# EAGLE design stm32h405-braids-panel (EAGLE 7.3.0)
UI for Olimex STM32H103 or H405 board
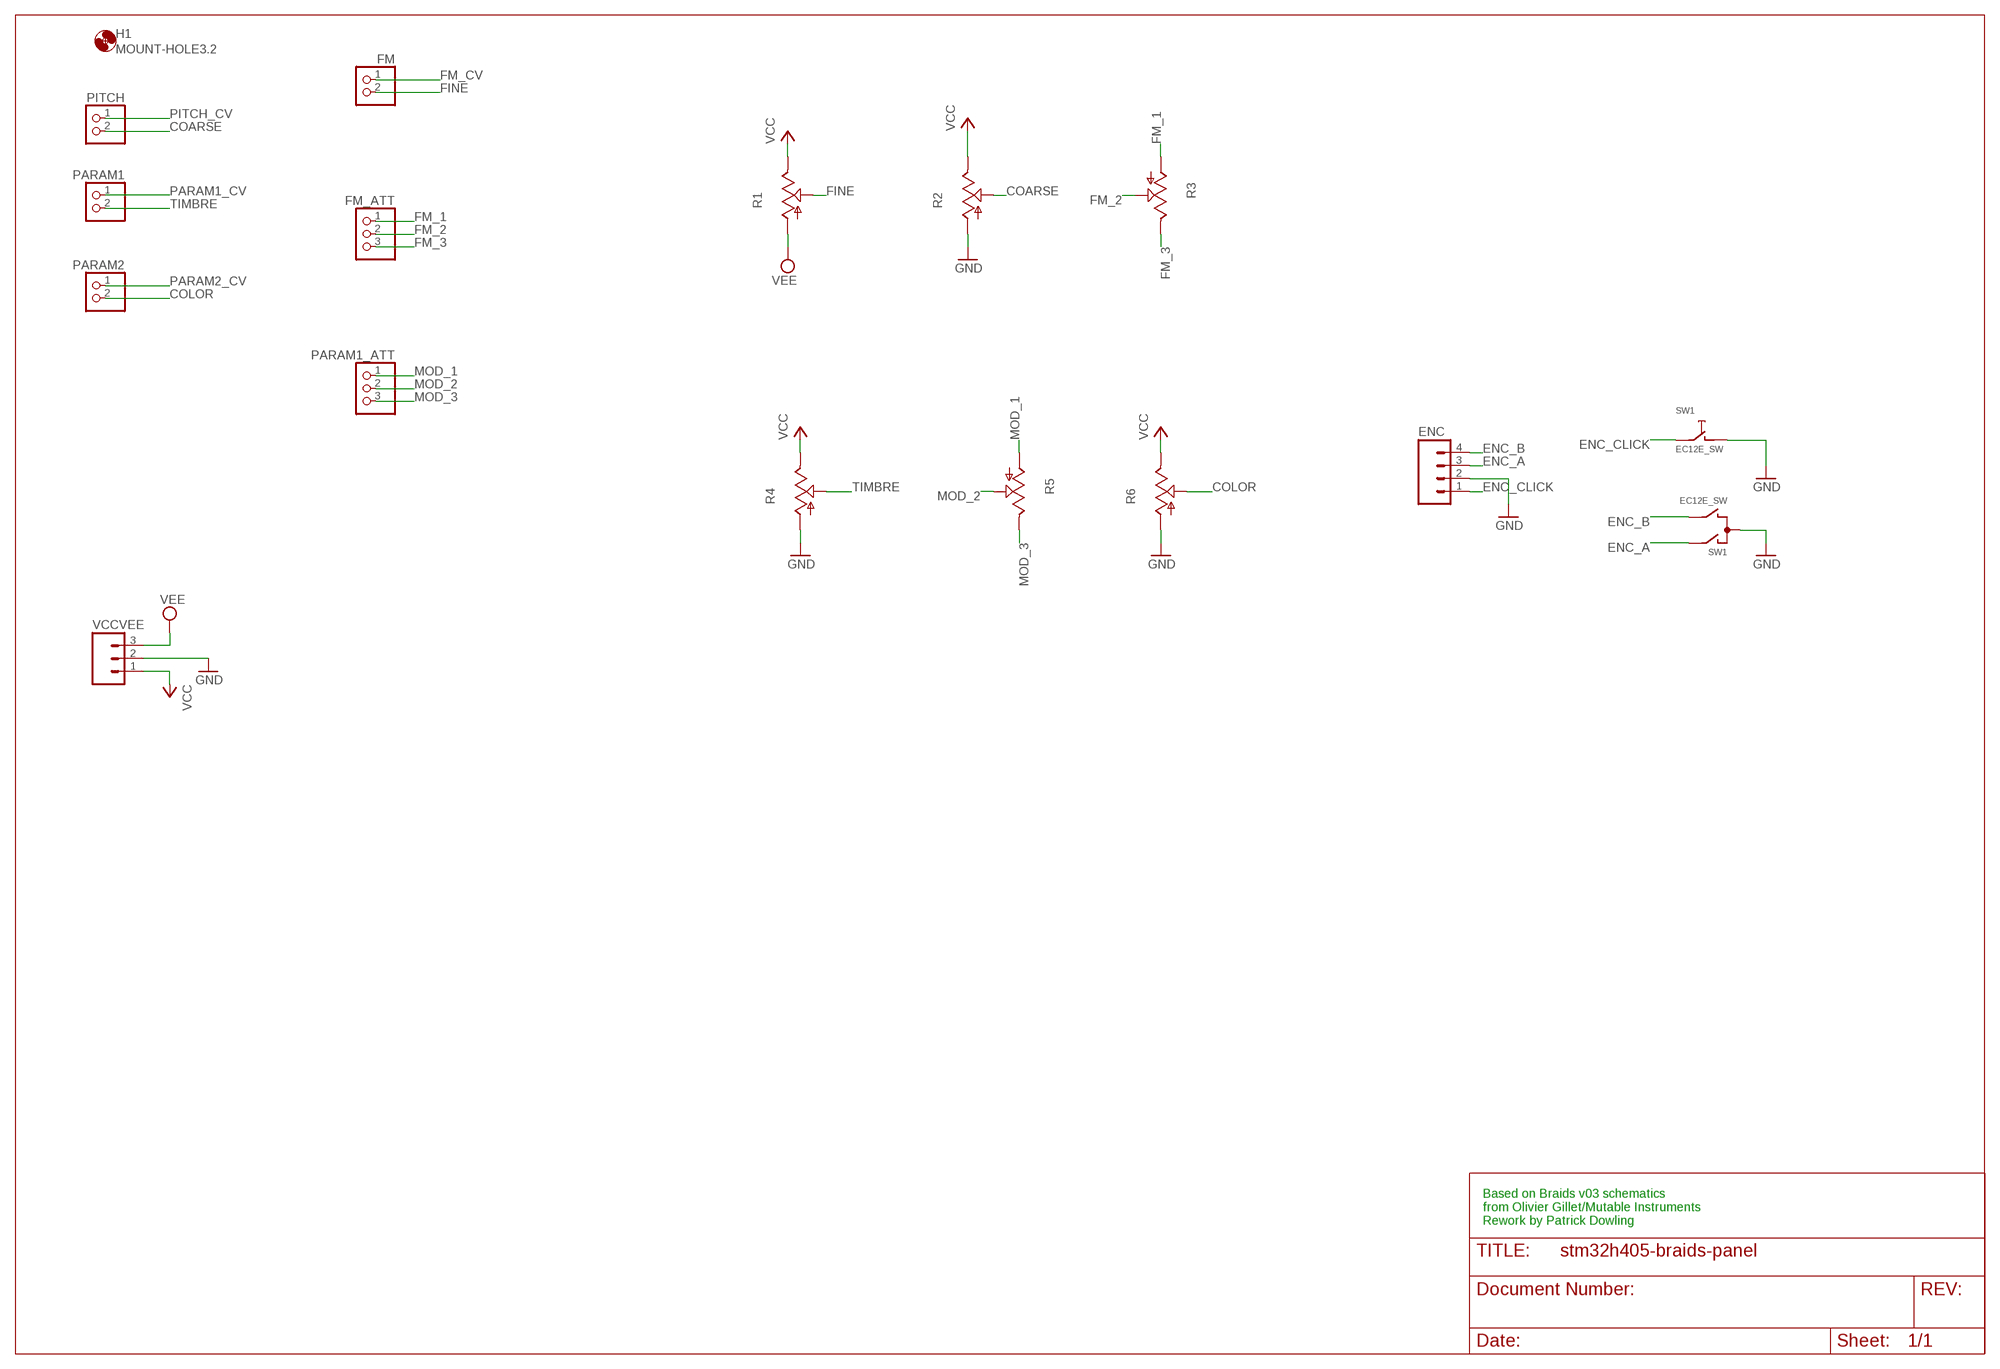
[diagram p0: schematic, sheet 1]

## Parts
ENC  M04PTH  [1X04]
FM  PINHD-1X2  [1X02]
FM_ATT  PINHD-1X3  [1X03]
H1  MOUNT-HOLE3.2  [3,2]
PARAM1  PINHD-1X2  [1X02]
PARAM1_ATT  PINHD-1X3  [1X03]
PARAM2  PINHD-1X2  [1X02]
PITCH  PINHD-1X2  [1X02]
R1  POT_USVERTICAL_PS  [ALPS_POT_VERTICAL_PS]
R2  POT_USVERTICAL_PS  [ALPS_POT_VERTICAL_PS]
R3  POT_USVERTICAL_PS  [ALPS_POT_VERTICAL_PS]
R4  POT_USVERTICAL_PS  [ALPS_POT_VERTICAL_PS]
R5  POT_USVERTICAL_PS  [ALPS_POT_VERTICAL_PS]
R6  POT_USVERTICAL_PS  [ALPS_POT_VERTICAL_PS]
SW1  EC12E_SW  [ALPS_EC12E_SW]
VCCVEE  M031X03_NO_SILK  [1X03_NO_SILK]

## Nets
COARSE: PITCH.2 R2.P$2(S)
COLOR: PARAM2.2 R6.P$2(S)
ENC_A: ENC.3 SW1.A
ENC_B: ENC.4 SW1.B
ENC_CLICK: ENC.1 SW1.E
FINE: FM.2 R1.P$2(S)
FM_1: FM_ATT.1 R3.P$3(A)
FM_2: FM_ATT.2 R3.P$2(S)
FM_3: FM_ATT.3 R3.P$1(E)
FM_CV: FM.1
GND: ENC.2 R2.P$3(A) R4.P$3(A) R6.P$3(A) SW1.C SW1.D VCCVEE.2
MOD_1: PARAM1_ATT.1 R5.P$3(A)
MOD_2: PARAM1_ATT.2 R5.P$2(S)
MOD_3: PARAM1_ATT.3 R5.P$1(E)
PARAM1_CV: PARAM1.1
PARAM2_CV: PARAM2.1
PITCH_CV: PITCH.1
TIMBRE: PARAM1.2 R4.P$2(S)
VCC [VCC]: R1.P$1(E) R2.P$1(E) R4.P$1(E) R6.P$1(E) VCCVEE.1
VEE [VEE]: R1.P$3(A) VCCVEE.3
Unconnected: SW1.GND1(G) SW1.GND2(G)

## Notes on the sheet
- Based on Braids v03 schematics
  from Olivier Gillet/Mutable Instruments
  Rework by Patrick Dowling

## Library data of the parts
ENC = SparkFun-Connectors:M04: Header 4 Standard 4-pin 0.1" header. Use with straight break away headers (SKU : PRT-00116), right angle break away headers (PRT-00553), swiss pins (PRT-00743), machine pins (PRT-00117), and female headers (PRT-00115). Molex polarized connector foot print use with SKU : PRT-08231 with associated crimp pins and housings. 1MM SMD Version SKU: PRT-10208
FM PARAM1 PARAM2 PITCH = pinhead:PINHD-1X2: PIN HEADER
FM_ATT PARAM1_ATT = pinhead:PINHD-1X3: PIN HEADER
H1 = holes:MOUNT-HOLE: MOUNTING HOLE with drill center marker
R1-R6 = og-pots:POT_US
SW1 = og-encoder:EC12E_SW: ALPS rotary Encoder EC12E series with switch
VCCVEE = SparkFun-Connectors:M03: Header 3 Standard 3-pin 0.1" header. Use with straight break away headers (SKU : PRT-00116), right angle break away headers (PRT-00553), swiss pins (PRT-00743), machine pins (PRT-00117), and female headers (PRT-00115). Molex polarized connector foot print use with SKU : PRT-08232 with associated crimp pins and housings.

## Net classes
1 VDDA: width 0.305 mm
2 VDD: width 0.305 mm
3 VEE: width 0.305 mm
4 VCC: width 0.305 mm
5 AREF: width 0.305 mm

## Board
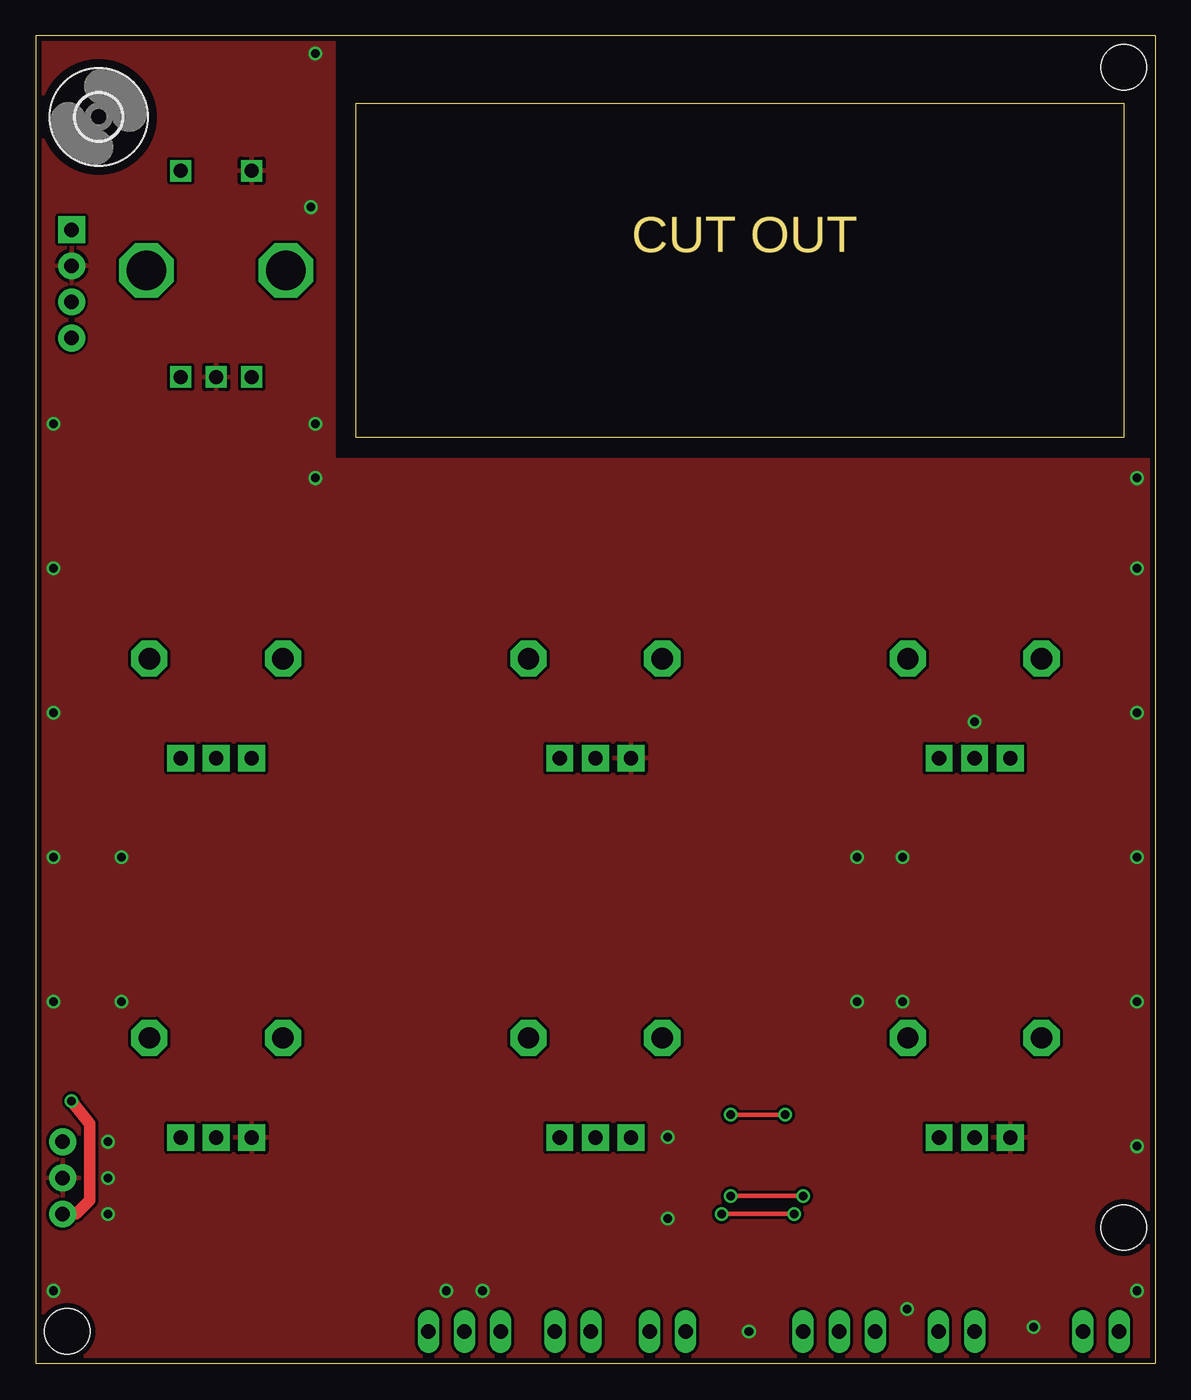
[diagram p1: board, top side]
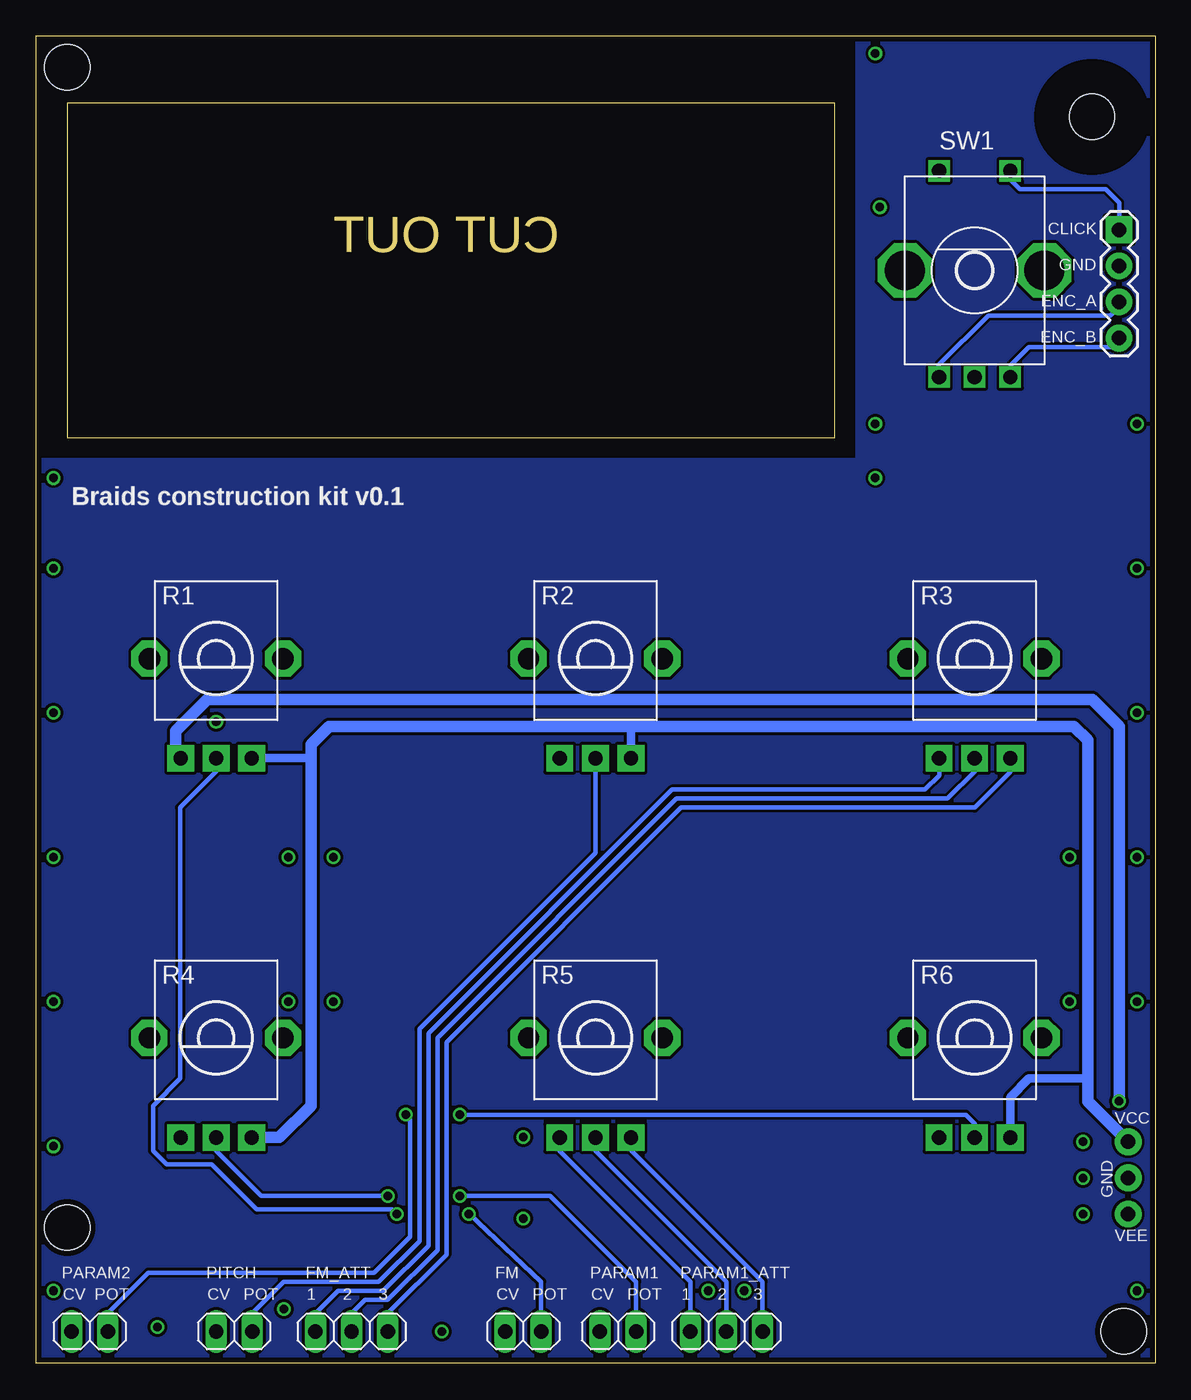
[diagram p2: board, bottom side, seen from below]

Size 78.74 x 93.34 mm. Coordinates in mm from the lower left corner, seen from the top.
Outline: 0,0 78.74,0 78.74,93.34 0,93.34 0,0
Outline: 22.54,88.58 76.52,88.58 76.52,65.09 22.54,65.09 22.54,88.58
Copper layers (1*16): Top 0.0356mm / dielectric 1.5011mm / Bottom 0.0356mm
Design rules "LaenPCBOrder *": minimum track width 6mil, minimum drill 13mil, track to track 8mil, track to pad 8mil, pad to pad 8mil, via to via 8mil, smd to smd 6mil, copper to edge 15mil, drill to drill 6mil, minimum pad ring 7mil, minimum via ring 7mil, stop-mask expansion 3mil, vias tented up to drill 25mil, thermal gap 10mil
Holes 3.2 mm at 76.52,9.53 76.52,91.12 2.22,2.22

### Footprints (pad centres in the part's own frame; a part is rotated, then mirrored left to right if it is on the bottom)
1X04 = drill 1.016 pad 1.88 square: 1 0,0 | drill 1.016 pad 1.88: 2 2.54,0; 3 5.08,0; 4 7.62,0
1X02 = drill 1.016 long: 1 -1.27,0; 2 1.27,0
1X03 = drill 1.016 long: 1 -2.54,0; 2 0,0; 3 2.54,0
3,2 = hole 3.2: 0,0
ALPS_POT_VERTICAL_PS = drill 1 pad 1.88 square: P$1 -2.5,7; P$2 0,7; P$3 2.5,7 | drill 1.5 pad 2.54 octagon: P$4 -4.7,0; P$5 4.7,0
ALPS_EC12E_SW = drill 1 square: A -2.5,-7.5; B 2.5,-7.5; C 0,-7.5; D -2.5,7; E 2.5,7 | drill 2.8 octagon: GND1 -4.9,0; GND2 4.9,0
1X03_NO_SILK = drill 1.016 pad 1.88: 1 0,0; 2 2.54,0; 3 5.08,0

### Placement (x,y rotation side)
ENC  2.54,79.69 270 bottom
FM  44.45,2.22 0 bottom
FM_ATT  56.52,2.22 0 bottom
H1  4.45,87.63 0 top
PARAM1  37.78,2.22 0 bottom
PARAM1_ATT  30.16,2.22 0 bottom
PARAM2  74.93,2.22 0 bottom
PITCH  64.77,2.22 0 bottom
R1  66.04,49.53 180 bottom
R2  39.37,49.53 180 bottom
R3  12.7,49.53 180 bottom
R4  66.04,22.86 180 bottom
R5  39.37,22.86 180 bottom
R6  12.7,22.86 180 bottom
SW1  12.7,76.83 0 bottom
VCCVEE  1.91,15.56 270 top

### Tracks (layer width: path | path; a pad name or v marks a point on that pad's centre or on a via)
COARSE
  Bottom 0.305: R2.P$2 39.37,35.88 51.75,23.5 51.75,8.57 54.61,5.71 61.28,5.71 63.5,3.49 PITCH.2
COLOR  (via drill 0.6)
  Top 0.305: v48.9,17.46 v52.7,17.46
  Bottom 0.305: R6.P$2 12.7,16.83 13.34,17.46 v48.9,17.46 | v52.7,17.46 52.39,17.14 52.39,8.89 54.93,6.35 70.8,6.35 73.66,3.49 PARAM2.2
ENC_A
  Bottom 0.305: ENC.3 2.54,74.3 3.17,73.66 11.75,73.66 15.24,70.17 15.24,69.38 SW1.A
ENC_B
  Bottom 0.305: ENC.4 3.17,71.44 8.89,71.44 10.16,70.17 10.16,69.38 SW1.B
ENC_CLICK
  Bottom 0.254: 10.16,83.8 SW1.E
  Bottom 0.305: ENC.1 2.54,81.6 3.49,82.55 9.53,82.55 10.16,83.19 10.16,83.8
FINE  (via drill 0.6)
  Top 0.305: v48.26,10.48 v53.34,10.48
  Bottom 0.305: FM.2 43.18,5.71 v48.26,10.48 | v53.34,10.48 53.66,10.79 63.18,10.79 66.36,13.97 69.53,13.97 70.48,14.92 70.48,18.1 68.58,20 68.58,39.05 66.04,41.59 R1.P$2
FM_1
  Bottom 0.305: R3.P$3 15.2,41.31 16.19,40.32 33.97,40.32 51.12,23.18 51.12,8.26 54.29,5.08 57.47,5.08 59.05,3.49 FM_ATT.1
FM_2
  Bottom 0.305: R3.P$2 12.7,41.59 14.61,39.69 33.66,39.69 50.48,22.86 50.48,7.94 53.98,4.45 55.56,4.45 56.52,3.49 FM_ATT.2
FM_3
  Bottom 0.305: R3.P$1 10.2,41.55 12.7,39.05 33.34,39.05 49.85,22.54 49.85,7.62 53.98,3.49 FM_ATT.3
GND  (via drill 0.6)
  other vias: 50.16,2.22 70.17,2.54 6.03,35.56 66.04,45.09 60.96,35.56 60.96,25.4 44.45,15.88 44.45,10.16 31.43,5.08 28.89,5.08 61.28,3.81 5.08,15.56 5.08,13.02 5.08,10.48 1.27,5.08 77.47,15.24 77.47,5.08 77.47,25.4 77.47,35.56 77.47,45.72 77.47,55.88 1.27,55.88 1.27,45.72 1.27,35.56 1.27,25.4 1.27,66.04 19.68,66.04 19.37,81.28 19.68,92.08 77.47,62.23 57.78,35.56 57.78,25.4 6.03,25.4 19.68,62.23
  pour Top: 0,93.34 20.95,93.34 20.95,63.5 78.74,63.5 78.74,0 0,0
MOD_1
  Bottom 0.305: PARAM1_ATT.1 32.7,5.71 41.91,14.92 41.91,15.82 R5.P$3
MOD_2
  Bottom 0.305: PARAM1_ATT.2 30.16,5.71 39.37,14.92 R5.P$2
MOD_3
  Bottom 0.305: 27.62,1.59 PARAM1_ATT.3 27.62,5.71 36.83,14.92 36.83,15.82 R5.P$1
N$1
  pour Bottom: 0,93.34 20.95,93.34 20.95,63.5 78.74,63.5 78.74,0 0,0
TIMBRE  (via drill 0.6)
  Top 0.305: v53.98,11.75 v48.9,11.75
  Bottom 0.305: PARAM1.2 36.51,5.71 42.55,11.75 v48.9,11.75 | R4.P$2 66.04,14.92 62.87,11.75 v53.98,11.75
VCC
  Bottom 0.61: R2.P$1 36.87,44.73 36.83,44.77 | R1.P$1 59.39,42.53 59.37,42.55 | 63.52,15.88 R4.P$1 | R6.P$1 10.2,18.69 8.89,20 4.76,20
  Bottom 0.813: VCCVEE.1 4.76,18.41 4.76,20 4.76,43.81 5.71,44.77 36.83,44.77 58.1,44.77 59.37,43.5 59.37,42.55 59.37,18.1 61.59,15.88 63.52,15.88
VEE  (via drill 0.6)
  Top 0.813: VCCVEE.3 2.86,10.48 3.81,11.43 3.81,16.83 v2.54,18.41
  Bottom 0.813: v2.54,18.41 2.54,44.77 4.45,46.67 66.67,46.67 68.9,44.45 68.9,42.89 R1.P$3

### Text on the board
Dimension: CUT OUT
bPlace: CLICK | GND | ENC_A | ENC_B | VCC | GND | VEE | 3 | 2 | 1 | POT | CV | POT | CV | 3 | 2 | 1 | POT | CV | POT | CV
bNames: Braids construction kit v0.1